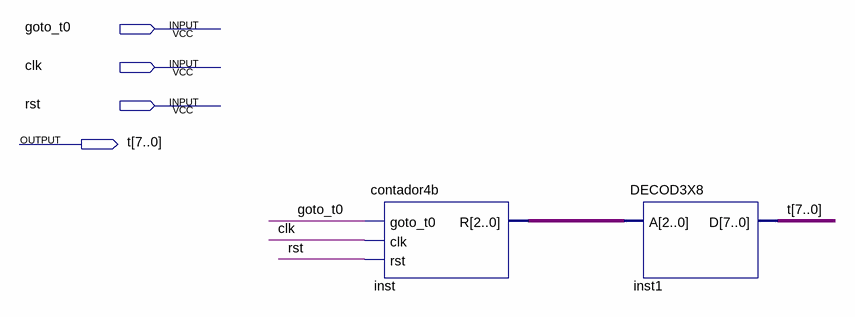
[diagram p0: schematic sheet]
// Quartus schematic temporizador.bdf as structural Verilog: 2 symbols, 4 pins
module temporizador (
  input  goto_t0,
  input  clk,
  input  rst,
  output [7:0] t
);

  wire [2:0] inst_r;

  contador4b inst (.goto_t0(goto_t0), .clk(clk), .rst(rst), .R(inst_r));
  DECOD3X8 inst1 (.A(inst_r), .D(t));
endmodule
